# EAGLE design lb_single-sided_uno_v2 (EAGLE 9.6.2)
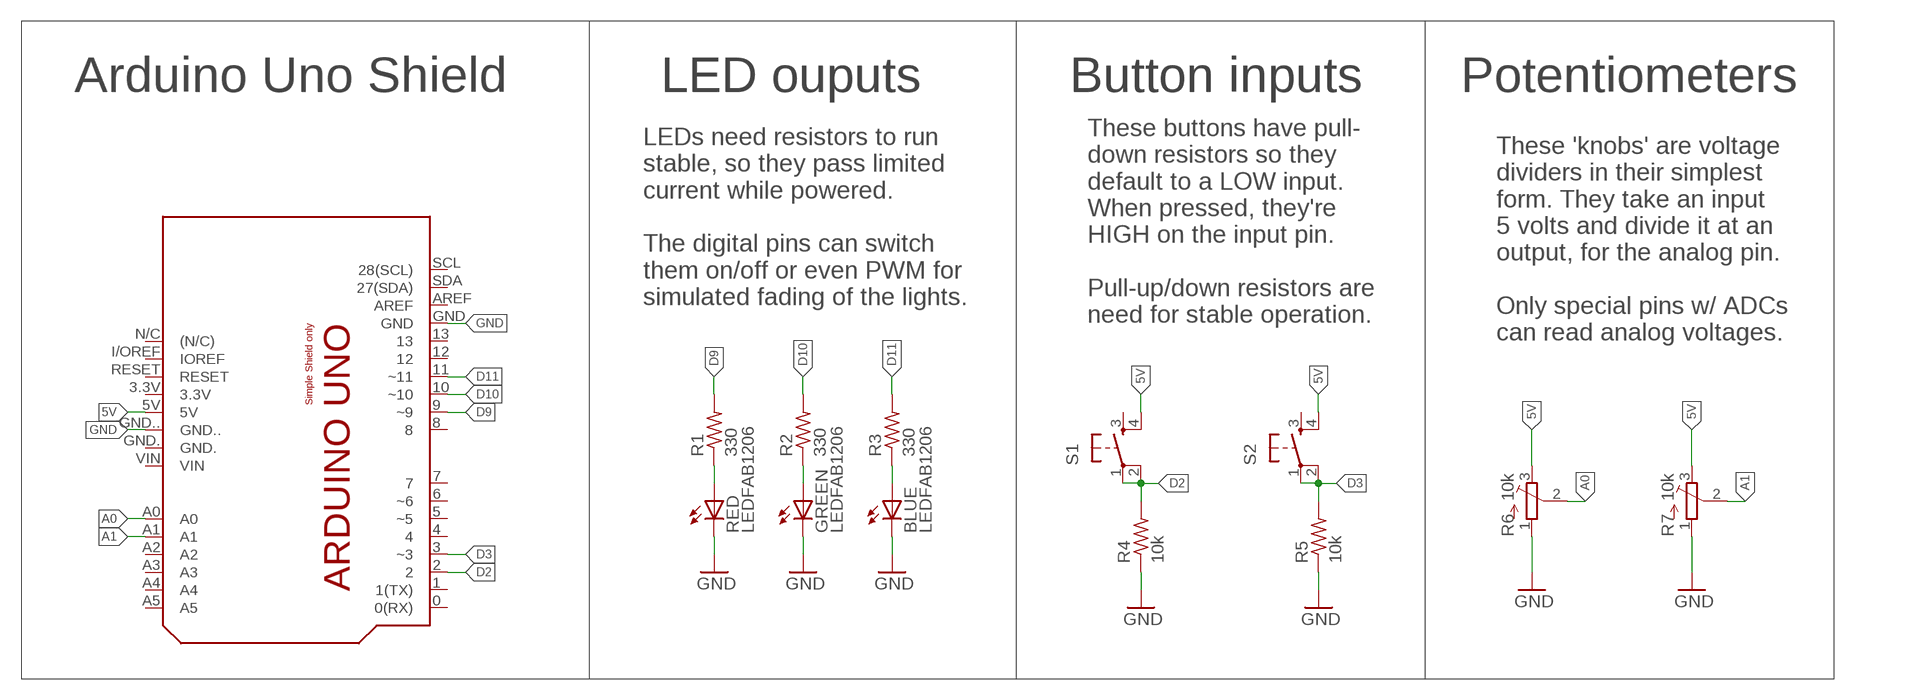
[diagram p0: schematic, sheet 1]

## Parts
BLUE  LEDFAB1206  [LED1206FAB]
GREEN  LEDFAB1206  [LED1206FAB]
PCB1  ARDUINO_UNO_V2  [ARDUINO_UNO_V2]
R1  330  RES-US1206FAB  [R1206FAB]
R2  330  RES-US1206FAB  [R1206FAB]
R3  330  RES-US1206FAB  [R1206FAB]
R4  10k  RES-US1206FAB  [R1206FAB]
R5  10k  RES-US1206FAB  [R1206FAB]
R6  10k  TRIMPOTTC33X  [TC33X]
R7  10k  TRIMPOTTC33X  [TC33X]
RED  LEDFAB1206  [LED1206FAB]
S1  6MM_SWITCH6MM_SWITCH  [6MM_SWITCH]
S2  6MM_SWITCH6MM_SWITCH  [6MM_SWITCH]

## Nets
5V: PCB1.5V R6.3(E) R7.3(E) S1.4(S1) S2.4(S1)
A0: PCB1.A0 R6.2(S)
A1: PCB1.A1 R7.2(S)
D2: PCB1.2 R4.2 S1.1(P) S1.2(P1)
D3: PCB1.3(~3) R5.2 S2.1(P) S2.2(P1)
D9: PCB1.9(~9) R1.2
D10: PCB1.10(~10) R2.2
D11: PCB1.11(~11) R3.2
GND: BLUE.2(C) GREEN.2(C) PCB1.GND PCB1.GND.. R4.1 R5.1 R6.1(A) R7.1(A) RED.2(C)
N$1: R1.1 RED.1(A)
N$2: GREEN.1(A) R2.1
N$3: BLUE.1(A) R3.1
Unconnected: PCB1.0(0(RX)) PCB1.1(1(TX)) PCB1.3.3V PCB1.4 PCB1.5(~5) PCB1.6(~6) PCB1.7 PCB1.8 PCB1.12 PCB1.13 PCB1.A2 PCB1.A3 PCB1.A4 PCB1.A5 PCB1.AREF PCB1.GND. PCB1.I/OREF(IOREF) PCB1.N/C((N/C)) PCB1.RESET PCB1.SCL(28(SCL)) PCB1.SDA(27(SDA)) PCB1.VIN S1.3(S) S2.3(S)

## Notes on the sheet
- Arduino Uno Shield | LED ouputs | Button inputs | Potentiometers
- LEDs need resistors to run
  stable, so they pass limited
  current while powered.
  
  The digital pins can switch
  them on/off or even PWM for
  simulated fading of the lights.
- These buttons have pull-
  down resistors so they 
  default to a LOW input. 
  When pressed, they're 
  HIGH on the input pin.
  
  Pull-up/down resistors are
  need for stable operation.
- These 'knobs' are voltage
  dividers in their simplest
  form. They take an input
  5 volts and divide it at an
  output, for the analog pin. 
  
  Only special pins w/ ADCs
  can read analog voltages.

## Library data of the parts
BLUE GREEN RED = fab:LED: LED
PCB1 = E14_Arduino_revC:ARDUINO_UNO_V2
R1-R5 = fab:RES-US: Resistor (US Symbol) Variants with postfix FAB are widened to allow the routing of internal traces
R6 R7 = adafruit:TRIMPOT: SMT trimmer potentiometer part number TC33X http://www.ladyada.net/library/eagle
S1 S2 = fab:6MM_SWITCH: OMRON SWITCH

## Board
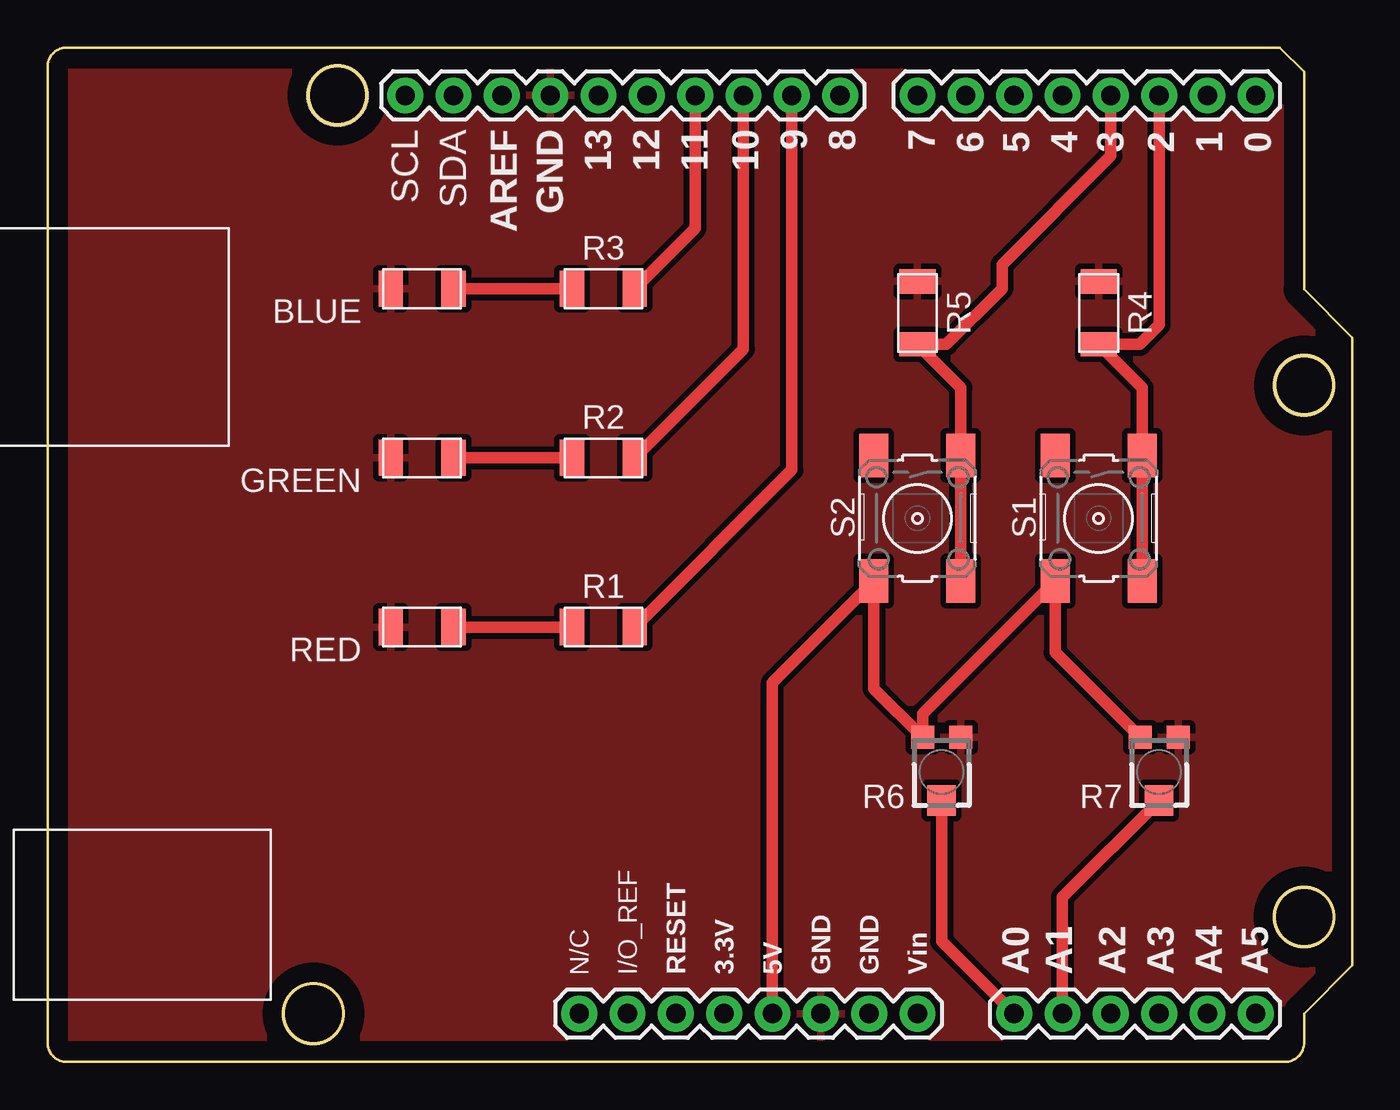
[diagram p1: board, top side]

Size 68.58 x 53.31 mm. Coordinates in mm from the lower left corner, seen from the top.
Copper layers (1*16): Top 0.035mm / dielectric 1.5mm / Bottom 0.035mm
Design rules "default *": minimum track width 12mil, minimum drill 0.35mm, track to track 12mil, track to pad 12mil, pad to pad 12mil, via to via 12mil, smd to smd 6mil, copper to edge 40mil, drill to drill 6mil, minimum pad ring 10mil, minimum via ring 8mil, stop-mask expansion 4mil, vias tented up to drill 0mil, thermal gap 12mil

### Footprints (pad centres in the part's own frame; a part is rotated, then mirrored left to right if it is on the bottom)
LED1206FAB = smd 1.27 x 1.905: 1 -1.651,0; 2 1.651,0
ARDUINO_UNO_V2 = drill 1.016 pad 1.88: 0 63.5,50.8; 1 60.96,50.8; 2 58.42,50.8; 3 55.88,50.8; 3.3V 35.56,2.54; 4 53.34,50.8; 5 50.8,50.8; 5V 38.1,2.54; 6 48.26,50.8; 7 45.72,50.8; 8 41.656,50.8; 9 39.116,50.8; 10 36.576,50.8; 11 34.036,50.8; 12 31.496,50.8; 13 28.956,50.8; A0 50.8,2.54; A1 53.34,2.54; A2 55.88,2.54; A3 58.42,2.54; A4 60.96,2.54; A5 63.5,2.54; AREF 23.876,50.8; GND 26.416,50.8; GND. 43.18,2.54; GND.. 40.64,2.54; I/OREF 30.48,2.54; N/C 27.94,2.54; RESET 33.02,2.54; SCL 18.796,50.8; SDA 21.336,50.8; VIN 45.72,2.54 | hole 3.2: 66.04,7.62; 66.04,35.56; 15.24,50.8; 13.97,2.54
R1206FAB = smd 1.27 x 1.905: 1 -1.651,0; 2 1.651,0
TC33X = smd 1.2 x 1.2: 1 -1,-1.825; 3 1,-1.825 | smd 1.5 x 1.6: 2 0,1.5
6MM_SWITCH = smd 2.286 x 1.524: 1 -3.302,2.286; 2 3.302,2.286; 3 -3.302,-2.286; 4 3.302,-2.286

### Placement (x,y rotation side)
BLUE  19.69,40.64 180 top
GREEN  19.69,31.75 180 top
PCB1  0,0 0 top
R1  29.21,22.86 0 top
R2  29.21,31.75 0 top
R3  29.21,40.64 0 top
R4  55.24,39.37 270 top
R5  45.72,39.37 270 top
R6  46.99,15.24 180 top
R7  58.42,15.24 180 top
RED  19.69,22.86 180 top
S1  55.24,28.57 270 top
S2  45.72,28.57 270 top

### Tracks (layer width: path | path; a pad name or v marks a point on that pad's centre or on a via)
5V
  Top 0.61: PCB1.5V 38.1,19.94 S2.4 43.43,19.62 R6.3 45.99,18.3 S1.4 52.96,21.53 R7.3
A0
  Top 0.61: R6.2 46.99,6.35 PCB1.A0
A1
  Top 0.61: R7.2 53.34,8.66 PCB1.A1
D2
  Top 0.406: S1.2 S1.1 57.53,32.38 57.53,35.43
  Top 0.61: S1.2 57.53,32.38 | S1.1 57.53,35.43 R4.2 57.4,37.72 58.42,38.73 PCB1.2
D3
  Top 0.406: S2.2 S2.1 48.01,32.38 48.01,35.43
  Top 0.61: S2.2 48.01,32.38 | S2.1 48.01,35.43 R5.2 47.24,37.72 50.16,40.64 50.16,41.91 55.88,47.62 PCB1.3
D9
  Top 0.61: R1.2 39.12,31.12 PCB1.9
D10
  Top 0.61: R2.2 36.58,37.47 PCB1.10
D11
  Top 0.61: R3.2 34.04,43.81 PCB1.11
GND
  pour Top: 0,53.34 68.58,53.34 68.58,0 0,0
N$1
  Top 0.61: RED.1 R1.1
N$2
  Top 0.61: GREEN.1 R2.1
N$3
  Top 0.61: BLUE.1 R3.1

### Text on the board
tRestrict: LED | LED | LED